# Altium schematic sheet CW340_USBHUB_ExtPorts.SchDoc: USB Hub Downstream
size A4
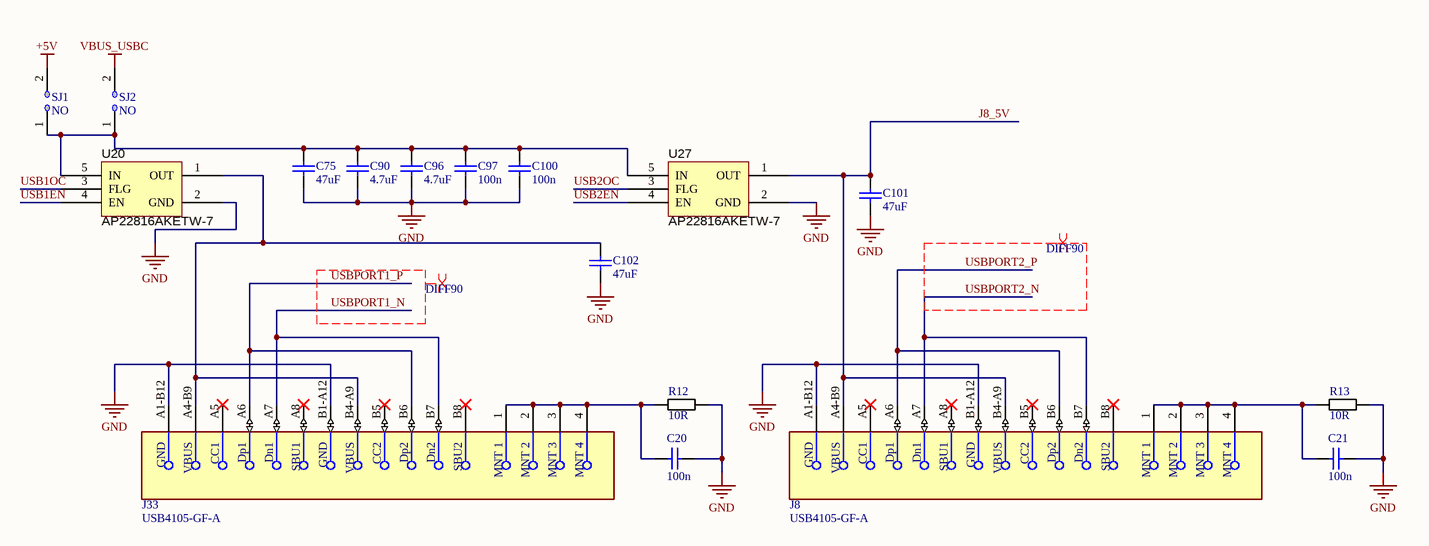
[diagram p0: CW340_USBHUB_ExtPorts.SchDoc]

## Parts
C20  100n  [CAPC0603_M]
C21  100n  [CAPC0603_M]
C75  47uF  [CAPC3225X20N]
C90  4.7uF  [CAPC0805_M]
C96  4.7uF  [CAPC0805_M]
C97  100n  [CAPC0402_M]
C100  100n  [CAPC0402_M]
C101  47uF  [CAPC3225X20N]
C102  47uF  [CAPC3225X20N]
J8  USB4105-GF-A  [FP-USB4105-GF-A-MFG]
J33  USB4105-GF-A  [FP-USB4105-GF-A-MFG]
R12  10R  [RESC1608X55N]
R13  10R  [RESC1608X55N]
SJ1  NO  [SJ_2S_NO]  (no BOM)
SJ2  NO  [SJ_2S_NO]  (no BOM)
U20  AP22816AKETW-7  [SOT23-5P95_285X145L45X40]
U27  AP22816AKETW-7  [SOT23-5P95_285X145L45X40]

## Nets
+5V: SJ1.2
GND: C20.2 C21.2 C75.2 C90.2 C96.2 C97.2 C100.2 C101.2 C102.2 J8.A1-B12(GND) J8.B1-A12(GND) J33.A1-B12(GND) J33.B1-A12(GND) R12.2 R13.2 U20.2(GND) U27.2(GND)
VBUS_USBC: SJ2.2
J8_5V: C101.1 J8.A4-B9(VBUS) J8.B4-A9(VBUS) U27.1(OUT)
USB1EN: U20.4(EN)
USB1OC: U20.3(FLG)
USB2EN: U27.4(EN)
USB2OC: U27.3(FLG)
USBPORT1_N: J33.A7(Dn1) J33.B7(Dn2)
USBPORT1_P: J33.A6(Dp1) J33.B6(Dp2)
USBPORT2_N: J8.A7(Dn1) J8.B7(Dn2)
USBPORT2_P: J8.A6(Dp1) J8.B6(Dp2)
NetC20_1: C20.1 J33.1(MNT_1) J33.2(MNT_2) J33.3(MNT_3) J33.4(MNT_4) R12.1
NetC21_1: C21.1 J8.1(MNT_1) J8.2(MNT_2) J8.3(MNT_3) J8.4(MNT_4) R13.1
NetC75_1: C75.1 C90.1 C96.1 C97.1 C100.1 SJ1.1 SJ2.1 U20.5(IN) U27.5(IN)
NetC102_1: C102.1 J33.A4-B9(VBUS) J33.B4-A9(VBUS) U20.1(OUT)

Not connected (* = marked no-connect by the designer): J8 A5(CC1)* A8(SBU1)* B5(CC2)* B8(SBU2)*; J33 A5(CC1)* A8(SBU1)* B5(CC2)* B8(SBU2)*

## Layout directives
differential pair; differential pair class DIFF90: USBPORT1_N, USBPORT1_P, USBPORT2_N, USBPORT2_P

## Library data of the parts
C20 C21 = CCHIP-100n-0603: 100n, 0603; Manufacture 1: Kemet; Manufacture Part Number 1: C0603C104K5RACTU; Component Group: Capacitor; Case-EIA: 0603; Case-Metric: 1608; Rated Voltage: 50VDC; Part Number: CCHIP-100n-0603; Footprint: 0603; Pin Count: 2; Supplier 1: Digi-Key; Supplier Part Number 1: 399-5089-2-ND; Value: 100n; Mounting Technology: SMT; Component Kind: Standard; Component Type: Standard
C75 C101 C102 = CCHIP-47u-1210: 47u, 10V, 1210, Ceramic; Manufacture 1: TDK Corporation; Manufacture Part Number 1: C3225X5R1A476M250AC; Component Group: Capacitor; Case-EIA: 1210; Case-Metric: 3225; Rated Voltage: 10VDC; Tolerance: 20%; Part Number: CCHIP-47u-1210; Footprint: 1210; Pin Count: 2; Supplier 1: Digi-Key; Supplier Part Number 1: 445-6711-1-ND; Value: 47uF; Mounting Technology: SMT; Temperature Range: -55C to 85C; Component Kind: Standard; Component Type: Standard
C90 C96 = CCHIP-4u7-0805-35V: 4u7, 35V, 0805, Ceramic; Manufacture 1: Murata; Manufacture Part Number 1: GRT21BC8YA475KE13L; Component Group: Capacitor; Case-EIA: 0805; Case-Metric: 1608; Rated Voltage: 35VDC; Tolerance: 10%; Part Number: CCHIP-4u7-0805-35V; Footprint: 0805; Pin Count: 2; Supplier 1: Digi-Key; Supplier Part Number 1: 490-12361-1-ND; Value: 4.7uF; Mounting Technology: SMT; Temperature Range: -55C to 85C; Component Kind: Standard; Component Type: Standard
C97 C100 = CCHIP-100n-0402: 100n, 0402; Manufacture Part Number 1: CGA2B3X7R1V104K050BB; Component Group: Capacitor; Case-EIA: 0402; Part Number: CCHIP-100n-0402; Footprint: 0402; Pin Count: 2; Value: 100n; Mounting Technology: SMT; Component Kind: Standard; Component Type: Standard; Supplier 1: Digi-Key; Supplier Part Number 1: 445-6901-1-ND
J8 J33 = CMP-245163-000001-1: CONN RCPT USB2.0 TYPEC 5A; Manufacturer: GCT; Voltage Rating: 20V; Is Female: yes; Current Rating: 5/6.25/1.25/0.25A; Number Of Contacts: 16; Conn Orientation: Right Angle; Device Class L1: Connectors; Category: Conn; Lead Free: Yes; RoHS: TRUE; Temperature Range High: +85°C; Digikey Description: CONN RCPT USB2.0 TYPEC 5A; Device Class L3: unset; ComponentLink2Description: Datasheet; Manufacturer Part Number: USB4105-GF-A; Package: 0; Usb Standard: USB 2.0; Device Class L2: USB Connectors; Automotive: No; Temperature Range Low: -40°C; Height: 3.46mm; Temperature: -40°C to +85°C; Contact Material: Gold,Nickel; ComponentLink2URL: https://gct.co/files/drawings/usb4105.pdf; Octopart: https://octopart.com/usb4105-gf-a-gct-106627878
R12 R13 = RCHIP-10R-0603: 10R res, 0603, 1%, 1/10W; Manufacture 1: Yageo; Manufacture Part Number 1: RC0603FR-0710RL; Component Group: Resistor; Case-EIA: 0603; Case-Metric: 1608; Rated Power: 0.1W; Rated Voltage: 75VDC; Part Number: RCHIP-10R-0603; Footprint: 0603; Pin Count: 2; Supplier 1: Digi-Key; Supplier Part Number 1: 311-10.0HRCT-ND; Value: 10R; Tolerance: 1%; Mounting Technology: SMT; Temperature Range: -55C to 155C; Component Kind: Standard; Component Type: Standard
SJ1 SJ2 = SJ_2S_NO: Solder Jumper, NO; Component Group: PCB Feature; Part Number: SJ_2S_NO; Pin Count: 2; Mounting Technology: COPPER; Component Type: Standard (No BOM)
U20 U27 = AP22816AKE: USB Power Switch, Digital IC; Manufacture 1: Diodes Inc; Manufacture Part Number 1: AP22816AKEWT-7; Company_PN: <Enter Company P/N>; Component Group: Analog IC; PP Material Stack: 0; Created By: D.GODDARD; Part Number: AP22816AKE; Footprint: SOT25; Pin Count: 5; Supplier 1: Mouser; Supplier Part Number 1: AP22816AKEWT-7; Mounting Technology: SMT; Component Kind: Standard; Component Type: Standard; PP Rotation: 0